# EAGLE schematic VL53L1X (EAGLE 8.3.2)
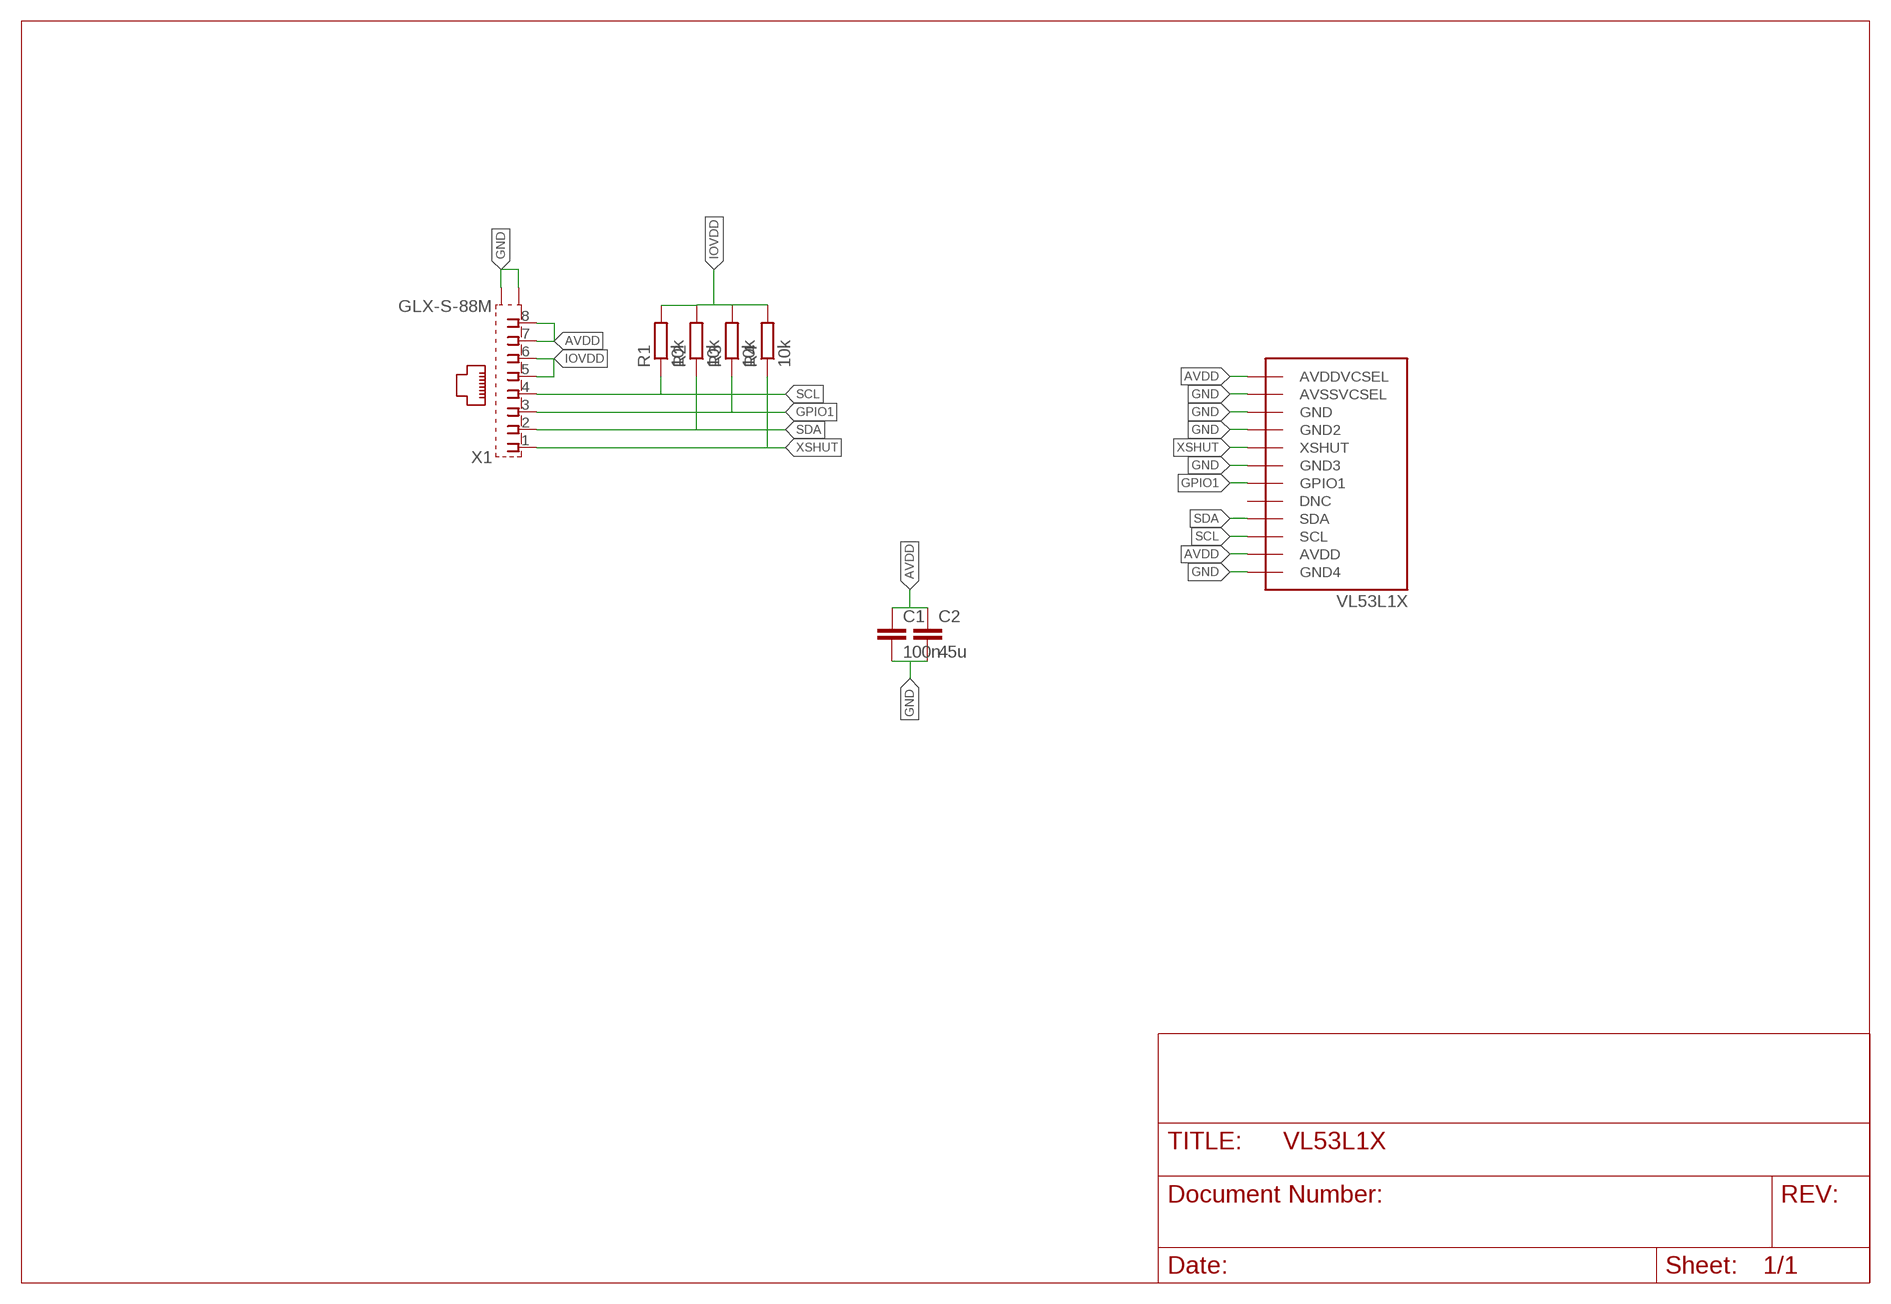
[diagram p0: schematic, sheet 1]

## Parts
C1  100n  C-EUC0603  [C0603]
C2  45u  C-EUC0603  [C0603]
R1  10k  R-EU_R0603  [R0603]
R2  10k  R-EU_R0603  [R0603]
R3  10k  R-EU_R0603  [R0603]
R4  10k  R-EU_R0603  [R0603]
U$1  VL53L1X  [VL53L1X]
X1  GLX-S-88M  [GLX-S-88M]

## Nets
AVDD: C1.1 C2.1 U$1.AVDD U$1.AVDDVCSEL X1.7 X1.8
GND: C1.2 C2.2 U$1.AVSSVCSEL U$1.GND U$1.GND2 U$1.GND3 U$1.GND4 X1.S1 X1.S2
GPIO1: R3.1 U$1.GPIO1 X1.3
IOVDD: R1.2 R2.2 R3.2 R4.2 X1.5 X1.6
SCL: R1.1 U$1.SCL X1.4
SDA: R2.1 U$1.SDA X1.2
XSHUT: R4.1 U$1.XSHUT X1.1
Unconnected: U$1.DNC

## Library data of the parts
C1 C2 = rcl:C-EU: CAPACITOR, European symbol
R1-R4 = rcl:R-EU_: RESISTOR, European symbol
U$1 = LIDAR:VL53L1X
X1 = con-kycon:GLX-S-88M: Mod. Jack, Right Angle, 8 posiotion, 8 contatcs RJ45 Source: GLX-S-88M.pdf; OC_FARNELL: unknown; OC_NEWARK: unknown